# Altium schematic sheet STM32.SchDoc
size A4
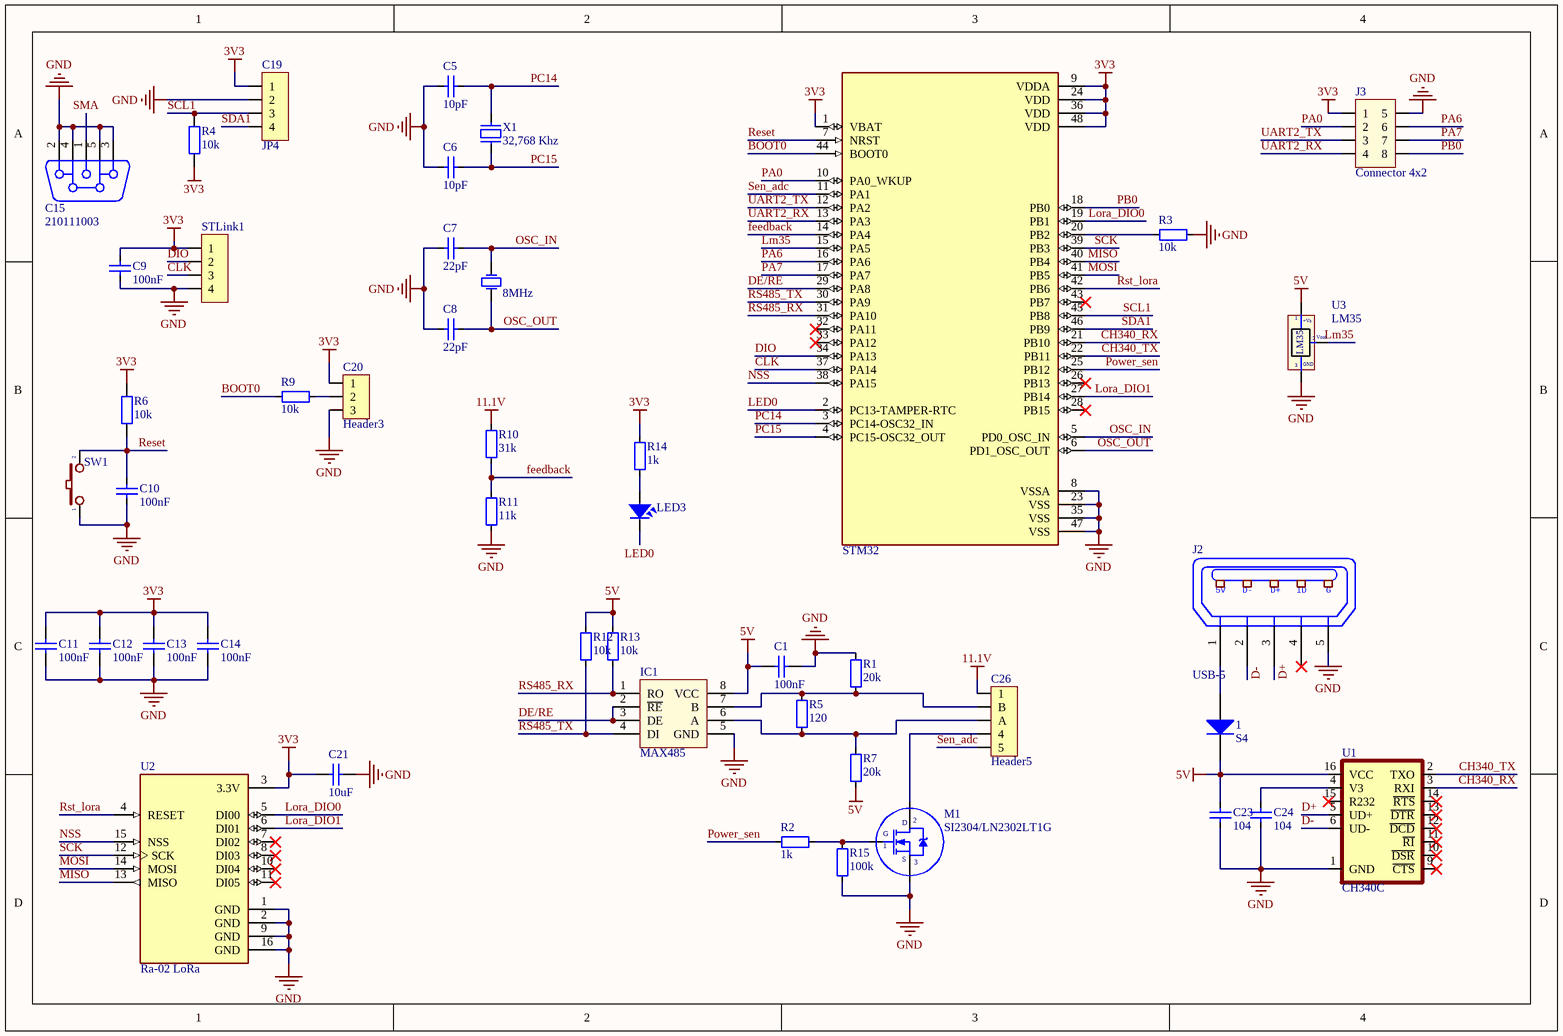
[diagram p0: STM32.SchDoc]

## Parts
1  S4  [DIO-214AC(SMA)]
C1  100nF  [CAP_0805]
C5  10pF  [CAP_0805]
C6  10pF  [CAP_0805]
C7  22pF  [CAP_0805]
C8  22pF  [CAP_0805]
C9  100nF  [CAP_0805]
C10  100nF  [CAP_0805]
C11  100nF  [CAP_0805]
C12  100nF  [CAP_0805]
C13  100nF  [CAP_0805]
C14  100nF  [CAP_0805]
C15  210111003  [SMA-RA]
C19  JP4  [JP4-C1T]
C20  Header3  [JP3]
C21  10uF  [CAP_0805]
C23  104  [CAP_0805]
C24  104  [CAP_0805]
C26  Header5  [KF5-5]
IC1  MAX485  [SO-8]
J2  USB-5  [USB-M1]
J3  Connector 4x2  [JP4x2]
LED3  LED  [LED-0805-Blue]  (value not drawn)
M1  SI2304/LN2302LT1G  [SOT23A]
R1  20k  [RES-SMD-0805]
R2  1k  [RES-SMD-0805]
R3  10k  [RES-SMD-0805]
R4  10k  [RES_SMD_0805]
R5  120  [RES-SMD-0805]
R6  10k  [RES_SMD_0805]
R7  20k  [RES-SMD-0805]
R9  10k  [RES-SMD-0805]
R10  31k  [RES-SMD-0805]
R11  11k  [RES-SMD-0805]
R12  10k  [RES-SMD-0805]
R13  10k  [RES-SMD-0805]
R14  1k  [RES-SMD-0805]
R15  100k  [RES-SMD-0805]
STLink1  JP4  [JP4-C1T]  (value not drawn)
STM32  STM32  [LQFP 48]  (value not drawn)
SW1  SW  [SW2]  (value not drawn)
U1  CH340C  [SOP-16]
U2  Ra-02 LoRa  [Ra-02]
U3  LM35  [QTO-92]
X1  32,768 Khz  [32k_SMD]
Y1  8MHz  [XTAL]

## Nets
3V3: C9.1 C11.1 C12.1 C13.1 C14.1 C19.1 C20.1 C21.1 J3.1 R4.1 R6.1 R14.1 STLink1.1 STM32.1(VBAT) STM32.9(VDDA) STM32.24(VDD) STM32.36(VDD) STM32.48(VDD) U2.3(3.3V)
5V: 1.2(K) C1.1 C23.2 IC1.8(VCC) R7.2 R12.1 R13.1 U1.16(VCC) U3.1(+Vs)
11.1V: C26.1 R10.1
GND: C1.2 C5.2 C6.2 C7.2 C8.2 C9.2 C10.2 C11.2 C12.2 C13.2 C14.2 C15.2 C15.3 C15.4 C15.5 C19.2 C20.3 C21.2 C23.1 C24.1 IC1.5(GND) J2.5(P5) J3.5 M1.3(S) R1.1 R3.1 R11.2 R15.1 STLink1.4 STM32.8(VSSA) STM32.23(VSS) STM32.35(VSS) STM32.47(VSS) SW1.1 U1.1(GND) U2.1(GND) U2.2(GND) U2.9(GND) U2.16(GND) U3.3(-)
BOOT0: R9.2 STM32.44(BOOT0)
CH340_RX: STM32.21(PB10) U1.3(RXI)
CH340_TX: STM32.22(PB11) U1.2(TXO)
CLK: STLink1.3 STM32.37(PA14)
D+: J2.3(P3) U1.5(UD+)
D-: J2.2(P2) U1.6(UD-)
DE/RE: IC1.2(~{RE}) IC1.3(DE) STM32.29(PA8)
DIO: STLink1.2 STM32.34(PA13)
feedback: R10.2 R11.1 STM32.14(PA4)
LED0: LED3.2 STM32.2(PC13-TAMPER-RTC)
Lm35: STM32.15(PA5) U3.2(Vout)
Lora_DIO0: STM32.19(PB1) U2.5(DI00)
Lora_DIO1: STM32.27(PB14) U2.6(DI01)
MISO: STM32.40(PB4) U2.13(MISO)
MOSI: STM32.41(PB5) U2.14(MOSI)
NSS: STM32.38(PA15) U2.15(NSS)
OSC_IN: C7.1 STM32.5(PD0_OSC_IN) Y1.2(OSC2)
OSC_OUT: C8.1 STM32.6(PD1_OSC_OUT) Y1.1(OSC1)
PA0: J3.2 STM32.10(PA0_WKUP)
PA6: J3.6 STM32.16(PA6)
PA7: J3.7 STM32.17(PA7)
PB0: J3.8 STM32.18(PB0)
PC14: C5.1 STM32.3(PC14-OSC32_IN) X1.1
PC15: C6.1 STM32.4(PC15-OSC32_OUT) X1.2
Power_sen: R2.1 STM32.25(PB12)
Reset: C10.1 R6.2 STM32.7(NRST) SW1.2
RS485_RX: IC1.1(RO) R13.2 STM32.31(PA10)
RS485_TX: IC1.4(DI) R12.2 STM32.30(PA9)
Rst_lora: STM32.42(PB6) U2.4(RESET)
SCK: STM32.39(PB3) U2.12(SCK)
SCL1: C19.3 R4.2 STM32.45(PB8)
SDA1: C19.4 STM32.46(PB9)
Sen_adc: C26.5 STM32.11(PA1)
SMA: C15.1
UART2_RX: J3.4 STM32.13(PA3)
UART2_TX: J3.3 STM32.12(PA2)
Net1_1: 1.1(A) J2.1(P1)
NetC20_2: C20.2 R9.1
NetC24_2: C24.2 U1.4(V3)
NetC26_2: C26.2(B) IC1.7(B) R1.2 R5.1
NetC26_3: C26.3(A) IC1.6(A) R5.2 R7.1
NetC26_4: C26.4 M1.2(D)
NetLED3_1: LED3.1 R14.2
NetM1_1: M1.1(G) R2.2 R15.2
NetR3_2: R3.2 STM32.20(PB2)

Not connected (* = marked no-connect by the designer): J2 4(P4)*; STM32 26(PB13)* 28(PB15)* 32(PA11)* 33(PA12)* 43(PB7)*; U1 9(~{CTS})* 10(~{DSR})* 11(~{RI})* 12(~{DCD})* 13(~{DTR})* 14(~{RTS})* 15(R232)*; U2 7(DI02)* 8(DI03)* 10(DI04)* 11(DI05)*

## Notes on the sheet
- (in symbol LM35) GND
- (in symbol USB-5) 5V; D-; D+; ID; G

## Library data of the parts
1 = Diode S4: Dán; Ten_Linh_Kien: Diode S4 SOD123 ( 1N5819 SOD123); Ma_Hang: MH005519; Don_Vi: Con; Ghi_Chu: *; Chung_Loai: Dán; Kieu_Chan: *
C1 C5-C14 C21 C23 C24 = CapSMD: Capacitor; Value: 33p; Published: 8-Jun-2000; LatestRevisionDate: 17-Jul-2002; LatestRevisionNote: Re-released for DXP Platform.; PackageReference: RAD-0.3; Publisher: Altium Limited
C15 = CON Ant: CONNECTOR ANTEN; Manufacturer: Würth Elektronik eiSos GmbH; partNo: 210111003; ComponentLink1Description: Manufacturer; ComponentLink1URL: http://www.we-online.de; Created by: Christin Zierenner; Created Date: May 2012; ComponentLink2Description: Datasheet; ComponentLink2URL: http://katalog.we-online.de/kataloge/eisos/index.php?language=en&pf=Filter_gerade
C19 STLink1 = JP4: WR-PHD 2.54 mm Angled Socket Header; Manufacturer: W¨¹rth Elektronik eiSos GmbH; partNo: 613004143121; ComponentLink1 Description: Manufacturer; ComponentLink2 Description: Datasheet; NoPins: 04; Created Date: 29 March 2013; ComponentLink1URL: http://www.we-online.com; ComponentLink2URL: http://katalog.we-online.de/em/datasheet/6130xx143121.pdf; Created by: Karrer Zheng
C20 = Header3: Header IDC, 3 x 1 Pin Vertical 2.54mm Pitch (Non-Boxed, Male); Manufacturer: W¨¹rth Elektronik eiSos GmbH; partNo: 613002143121; ComponentLink1 Description: Manufacturer; ComponentLink2 Description: Datasheet; NoPins: 02; Created Date: 29 March 2013; ComponentLink1URL: http://www.we-online.com; ComponentLink2URL: http://katalog.we-online.de/em/datasheet/6130xx143121.pdf; Created by: Karrer Zheng
C26 = Header5: Header IDC, 5 x 1 Pin Vertical 2.54mm Pitch (Non-Boxed, Male); Manufacturer: W¨¹rth Elektronik eiSos GmbH; partNo: 613002143121; ComponentLink1 Description: Manufacturer; ComponentLink2 Description: Datasheet; NoPins: 02; Created Date: 29 March 2013; ComponentLink1URL: http://www.we-online.com; ComponentLink2URL: http://katalog.we-online.de/em/datasheet/6130xx143121.pdf; Created by: Karrer Zheng
IC1 = MAX485: RS232 - RS485 (Same sn75176)
J2 = USB-5: Manufacturer: FCI; Manufacturer Part Number: 10118193-0001LF; Connector Type: USB - micro B; Number of Contacts: 5; Gender: Receptacle; Specifications: USB 2.0; .Creator: MM; .Checked PCB: RF; Supplier 1: Digi-Key; RoHS: RoHS Compliant; Category: Connectors, Interconnects; Stock 1: 28642; Pricing 1: 1=0.46, 10=0.433, 25=0.3712, 50=0.3156, 100=0.3032, 250=0.27224, 500=0.25988 (USD); Packaging: Cut Tape (CT); Mounting Type: Surface Mount, Right Angle, Horizontal; Features: Shielded, Solder Retention; Ingress Protection: -; ComponentLink1URL: http://portal.fciconnect.com/Comergent//fci/drawing/10118193.pdf; ComponentLink1Description: http://portal.fciconnect.com/Comergent//fci/drawing/10118193.pdf; Supplier Part Number 1: 609-4616-1-ND; .Checked SCH: MM
J3 = JP4x2: Value: Connector 4x2
LED3 = LED: LED Single colour Green and Red; Value: LED 3 ly Single Colour
M1 = MOSFET_N: Generic N Channel MOSFET
R1-R3 R5 R7 R9-R15 = Resistor - SMD: Resistor; Manufacturer: Generic Components; Class: Passive; Published: 08/06/2000; Publisher: Altium Hobart Technology Centre
R4 R6 = Resistor - SMD: Resistor SMD; Manufacturer: Generic Components; Class: Passive; Published: 08/06/2000; Publisher: Altium Hobart Technology Centre
STM32 = STM32F103C8T6: STM32 ARM-based 32-bit MCU with 64 Kbytes Flash, 64-pin LQFP, Industrial Temperature
SW1 = SW2: Switch button 2 pin; Value: SW chip 2 pin
U1 = CH340C: USB to serial chip CH340; MF: WCH; Package: Package; Check_prices: https://www.snapeda.com/parts/CH340C/WCH/view-part/5428851/?ref=eda; Value: *; Price: None; MP: CH340C; Availability: Unavailable; SnapEDA_Link: https://www.snapeda.com/parts/CH340C/WCH/view-part/5428851/?ref=snap
U2 = Ra-02 LoRa: LoRa Module Ra-02
U3 = LM35: Teminal; Value: LM35
X1 = XT32k: Crystal 32,768kHz for timer real; Value: 32,768khz
Y1 = XTAL: Crystal Oscillator; Published: 8-Jun-2000; LatestRevisionDate: 17-Jul-2002; LatestRevisionNote: Re-released for DXP Platform.; PackageReference: R38; Publisher: Altium Limited